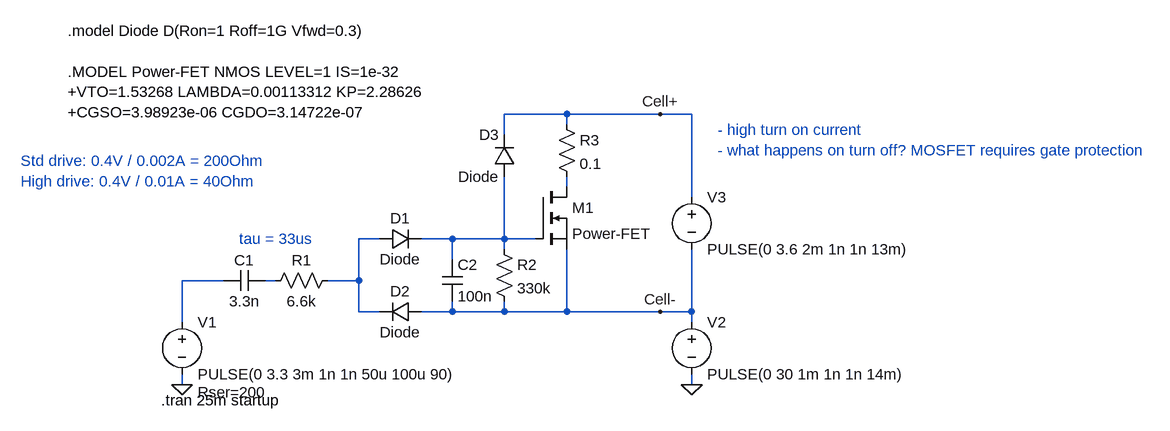
[diagram p0: schematic Level-Shifter_Capacitor.asc]
Level-Shifter_Capacitor.asc, the LTspice schematic file:
Version 4
SHEET 1 1812 1420
WIRE 704 -144 608 -144
WIRE 848 -144 704 -144
WIRE 896 -144 848 -144
WIRE 704 -128 704 -144
WIRE 608 -112 608 -144
WIRE 704 -32 704 -48
WIRE 896 -16 896 -144
WIRE 416 48 384 48
WIRE 528 48 480 48
WIRE 608 48 608 -48
WIRE 608 48 528 48
WIRE 656 48 608 48
WIRE 608 64 608 48
WIRE 528 80 528 48
WIRE 176 112 112 112
WIRE 256 112 240 112
WIRE 384 112 384 48
WIRE 384 112 336 112
WIRE 384 160 384 112
WIRE 416 160 384 160
WIRE 528 160 528 144
WIRE 528 160 480 160
WIRE 608 160 608 144
WIRE 608 160 528 160
WIRE 704 160 704 64
WIRE 704 160 608 160
WIRE 848 160 704 160
WIRE 896 160 896 64
WIRE 896 160 848 160
WIRE 112 176 112 112
WIRE 896 176 896 160
WIRE 112 272 112 256
WIRE 896 272 896 256
FLAG 112 272 0
FLAG 896 272 0
FLAG 848 160 Cell-
FLAG 848 -144 Cell+
SYMBOL voltage 112 160 R0
WINDOW 123 0 0 Left 0
WINDOW 39 24 124 Left 2
SYMATTR SpiceLine Rser=200
SYMATTR InstName V1
SYMATTR Value PULSE(0 3.3 3m 1n 1n 50u 100u 90)
SYMBOL voltage 896 160 R0
WINDOW 123 0 0 Left 0
WINDOW 39 0 0 Left 0
SYMATTR InstName V2
SYMATTR Value PULSE(0 30 1m 1n 1n 14m)
SYMBOL voltage 896 -32 R0
WINDOW 123 0 0 Left 0
WINDOW 39 0 0 Left 0
SYMATTR InstName V3
SYMATTR Value PULSE(0 3.6 2m 1n 1n 13m)
SYMBOL cap 240 96 R90
WINDOW 0 0 32 VBottom 2
WINDOW 3 32 32 VTop 2
SYMATTR InstName C1
SYMATTR Value 3.3n
SYMBOL nmos 656 -32 R0
SYMATTR InstName M1
SYMATTR Value Power-FET
SYMBOL res 352 96 R90
WINDOW 0 0 56 VBottom 2
WINDOW 3 32 56 VTop 2
SYMATTR InstName R1
SYMATTR Value 6.6k
SYMBOL cap 512 80 R0
SYMATTR InstName C2
SYMATTR Value 100n
SYMBOL diode 416 64 R270
WINDOW 0 32 32 VTop 2
WINDOW 3 0 32 VBottom 2
SYMATTR InstName D1
SYMATTR Value Diode
SYMBOL res 592 48 R0
SYMATTR InstName R2
SYMATTR Value 330k
SYMBOL diode 480 144 R90
WINDOW 0 0 32 VBottom 2
WINDOW 3 32 32 VTop 2
SYMATTR InstName D2
SYMATTR Value Diode
SYMBOL diode 624 -48 R180
WINDOW 0 24 64 Left 2
WINDOW 3 24 0 Left 2
SYMATTR InstName D3
SYMATTR Value Diode
SYMBOL res 688 -144 R0
SYMATTR InstName R3
SYMATTR Value 0.1
TEXT 80 296 Left 2 !.tran 25m startup
TEXT 936 -120 Left 2 ;- high turn on current\n- what happens on turn off? MOSFET requires gate protection
TEXT -64 -272 Left 2 !.model Diode D(Ron=1 Roff=1G Vfwd=0.3)\n \n.MODEL Power-FET NMOS LEVEL=1 IS=1e-32\n+VTO=1.53268 LAMBDA=0.00113312 KP=2.28626\n+CGSO=3.98923e-06 CGDO=3.14722e-07
TEXT 200 48 Left 2 ;tau = 33us
TEXT -136 -72 Left 2 ;Std drive: 0.4V / 0.002A = 200Ohm\nHigh drive: 0.4V / 0.01A = 40Ohm

The netlist it stands for:
* Level-Shifter_Capacitor.asc
V1 N004 0 PULSE(0 3.3 3m 1n 1n 50u 100u 90) Rser=200
V2 Cell- 0 PULSE(0 30 1m 1n 1n 14m)
V3 Cell+ Cell- PULSE(0 3.6 2m 1n 1n 13m)
C1 N005 N004 3.3n
M1 N001 N003 Cell- Cell- Power-FET
R1 N002 N005 6.6k
C2 N003 Cell- 100n
D1 N002 N003 Diode
R2 N003 Cell- 330k
D2 Cell- N002 Diode
D3 N003 Cell+ Diode
R3 Cell+ N001 0.1
.model D D
.lib standard.dio
.model NMOS NMOS
.model PMOS PMOS
.lib standard.mos
.tran 25m startup
* - high turn on current
* - what happens on turn off? MOSFET requires gate protection
.model Diode D(Ron=1 Roff=1G Vfwd=0.3)
.MODEL Power-FET NMOS LEVEL=1 IS=1e-32
+VTO=1.53268 LAMBDA=0.00113312 KP=2.28626
+CGSO=3.98923e-06 CGDO=3.14722e-07
* tau = 33us
* Std drive: 0.4V / 0.002A = 200Ohm
* High drive: 0.4V / 0.01A = 40Ohm
.backanno
.end